# EAGLE design PIC32_dev (EAGLE 6.5.0)
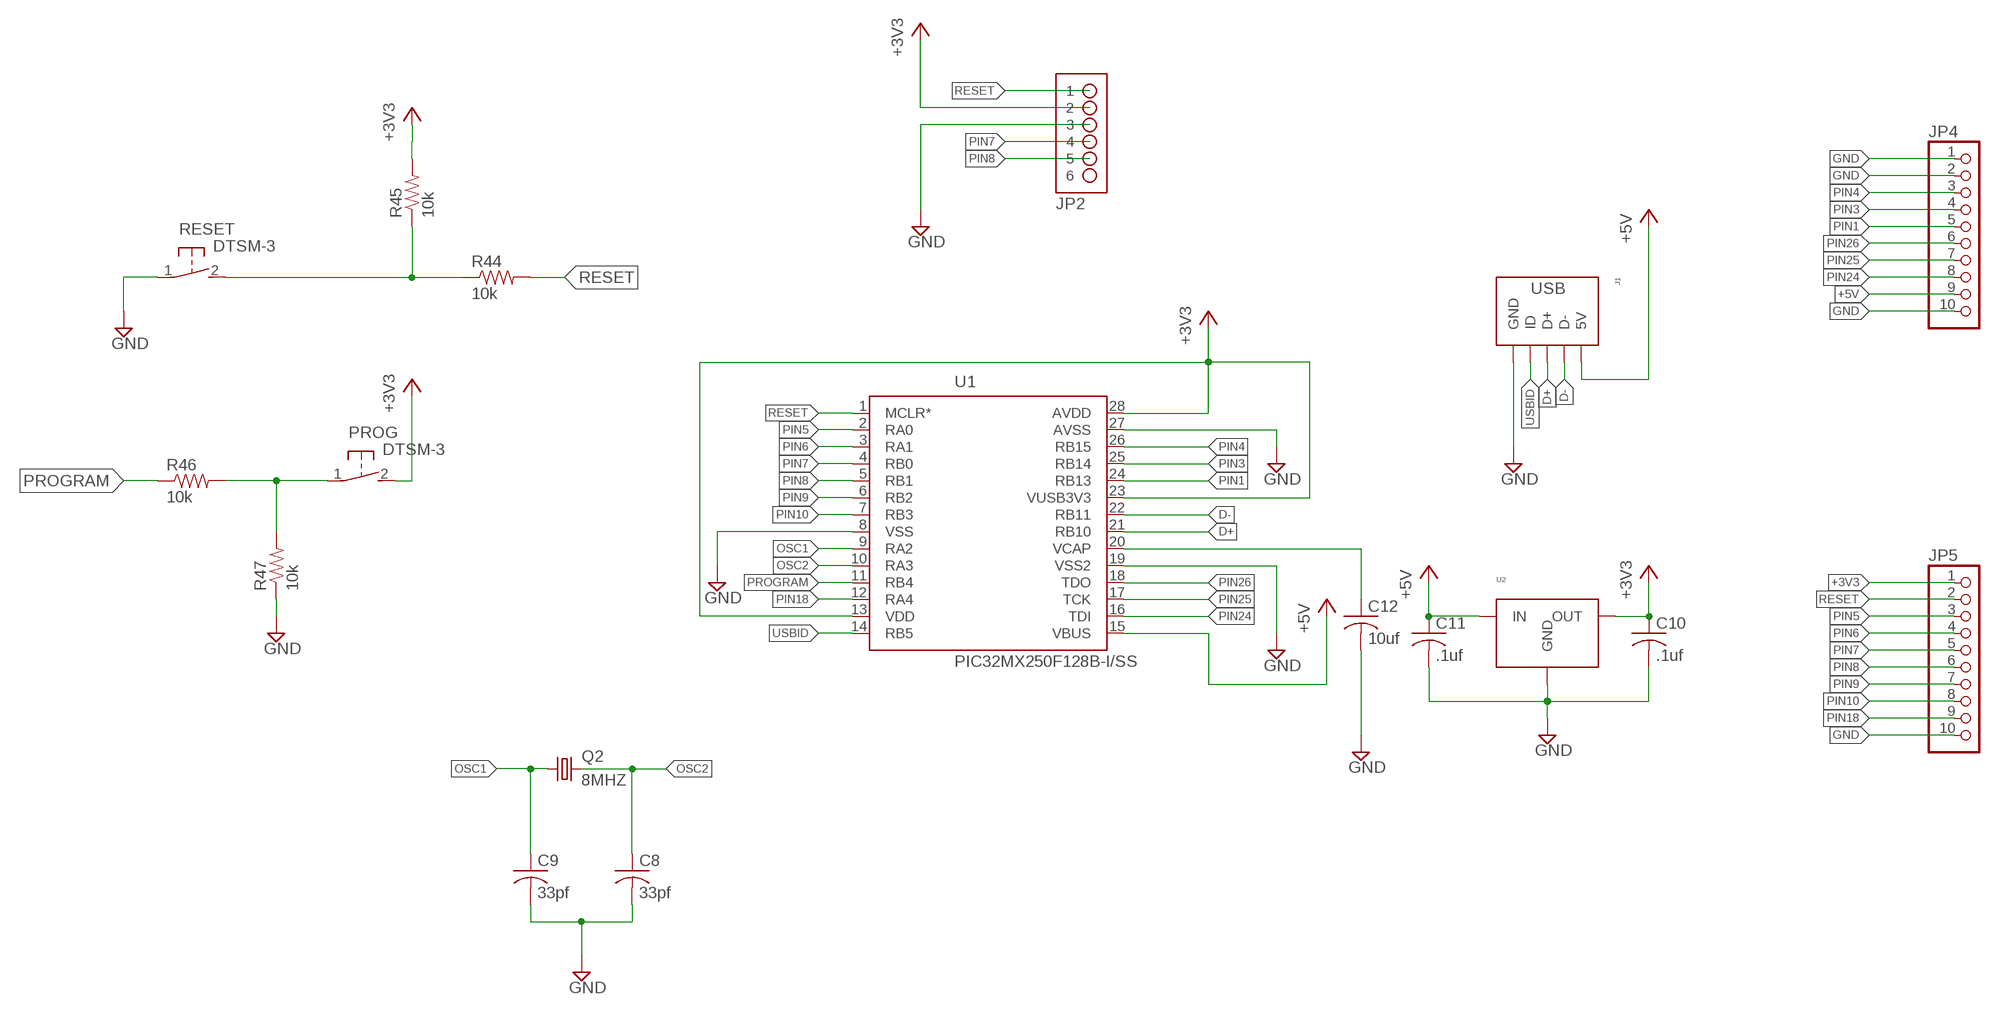
[diagram p0: schematic, sheet 1]

## Parts
C8  33pf  C-USC1206  [C1206]
C9  33pf  C-USC1206  [C1206]
C10  .1uf  C-USC1206  [C1206]
C11  .1uf  C-USC1206  [C1206]
C12  10uf  C-USC1206  [C1206]
J1  USBMC32599  [MC32599]
JP2  HDR-1X6-OFFSET  [HDR-1X6_OFFSET]
JP4  PINHD-1X10  [1X10]
JP5  PINHD-1X10  [1X10]
PROG  DTSM-3  [DTSM-3]
Q2  8MHZ  CRYSTALCTS406  [CTS406]
R44  10k  RESISTOR1206  [1206]
R45  10k  RESISTOR1206  [1206]
R46  10k  RESISTOR1206  [1206]
R47  10k  RESISTOR1206  [1206]
RESET  DTSM-3  [DTSM-3]
U1  PIC32MX250F128B-I/SS  [SOP65P780X200-28N]
U2  FIXED_VOLTAGE_REGDPAK-3  [DPAK-3]

## Nets
+3V3: C10.1 JP2.2 JP5.1 PROG.2 R45.2 U1.13(VDD) U1.23(VUSB3V3) U1.28(AVDD) U2.2(OUT)
+5V: C11.1 J1.V_BUS(5V) JP4.9 U1.15(VBUS) U2.1(IN)
D+: J1.D+ U1.21(RB10)
D-: J1.D- U1.22(RB11)
GND: C8.2 C9.2 C10.2 C11.2 C12.2 J1.GND J1.SH_0(GND) J1.SH_1(GND) J1.SH_2(GND) J1.SH_3(GND) JP2.3 JP4.1 JP4.2 JP4.10 JP5.10 R47.1 RESET.1 U1.8(VSS) U1.19(VSS2) U1.27(AVSS) U2.4(GND)
N$43: C12.1 U1.20(VCAP)
N$58: R44.1 R45.1 RESET.2
N$59: PROG.1 R46.2 R47.2
OSC1: C9.1 Q2.1 U1.9(RA2)
OSC2: C8.1 Q2.3 U1.10(RA3)
PIN1: JP4.5 U1.24(RB13)
PIN3: JP4.4 U1.25(RB14)
PIN4: JP4.3 U1.26(RB15)
PIN5: JP5.3 U1.2(RA0)
PIN6: JP5.4 U1.3(RA1)
PIN7: JP2.4 JP5.5 U1.4(RB0)
PIN8: JP2.5 JP5.6 U1.5(RB1)
PIN9: JP5.7 U1.6(RB2)
PIN10: JP5.8 U1.7(RB3)
PIN18: JP5.9 U1.12(RA4)
PIN24: JP4.8 U1.16(TDI)
PIN25: JP4.7 U1.17(TCK)
PIN26: JP4.6 U1.18(TDO)
PROGRAM: R46.1 U1.11(RB4)
RESET: JP2.1 JP5.2 R44.2 U1.1(MCLR*)
USBID: J1.N/C(ID) U1.14(RB5)
Unconnected: JP2.6

## Library data of the parts
C8-C11 = resistor:C-US: CAPACITOR, American symbol
C12 = rcl:C-US: CAPACITOR, American symbol
J1 = PP_Connectors:USB
JP2 = Mechanical:HDR-1X6-OFFSET: 42 mil hole pattern with 16mil offset for jtag connector
JP4 JP5 = pinhead:PINHD-1X10: PIN HEADER
PROG RESET = a328_dev_v2.4:DTSM-3
Q2 = crystal:CRYSTAL: CRYSTAL; OC_FARNELL: unknown; OC_NEWARK: unknown
R44-R47 = SparkFun-Resistors:RESISTOR: Resistor Basic schematic elements and footprints for 0603, 1206, and PTH resistors.
U1 = Microchip-PIC32MX1-2-3-4-5-6-7:PIC32MX2: IC,32-bit Microcontrollers (up to 128 KB Flash and 32 KB SRAM) with Audio and Graphics Interfaces, USB, and Advanced Analog; MPN: PIC32MX250F128B-I/SS; OC_FARNELL: 2097774; OC_NEWARK: 73T1454; PACKAGE: 28-Lead SSOP; SUPPLIER: Microchip
U2 = PP_PowerIC:FIXED_VOLTAGE_REG

## Board
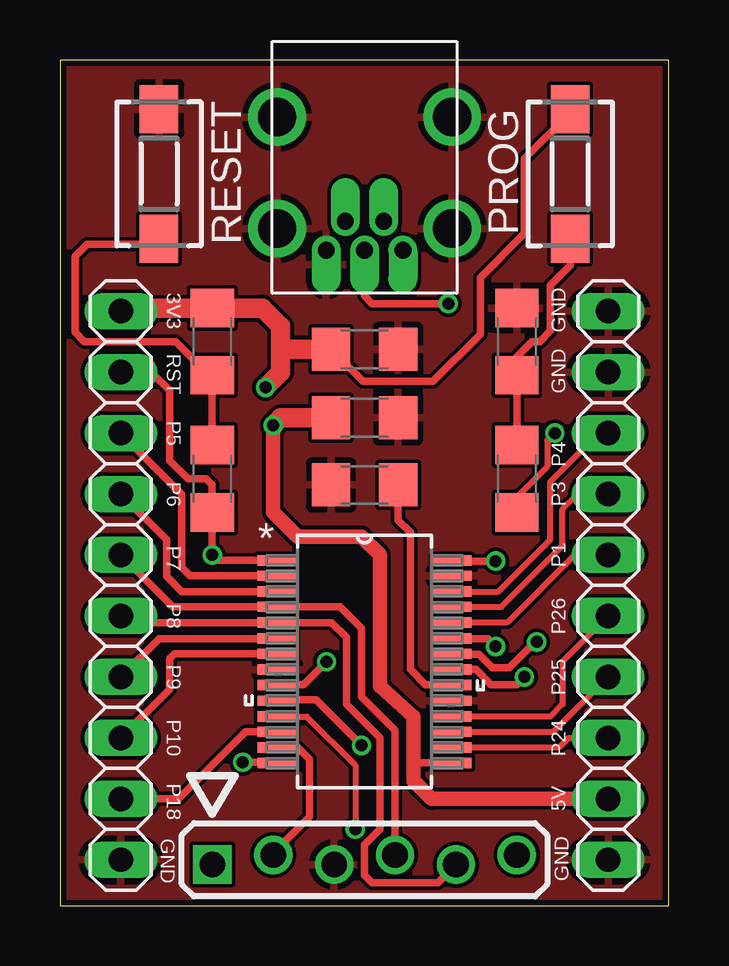
[diagram p1: board, top side]
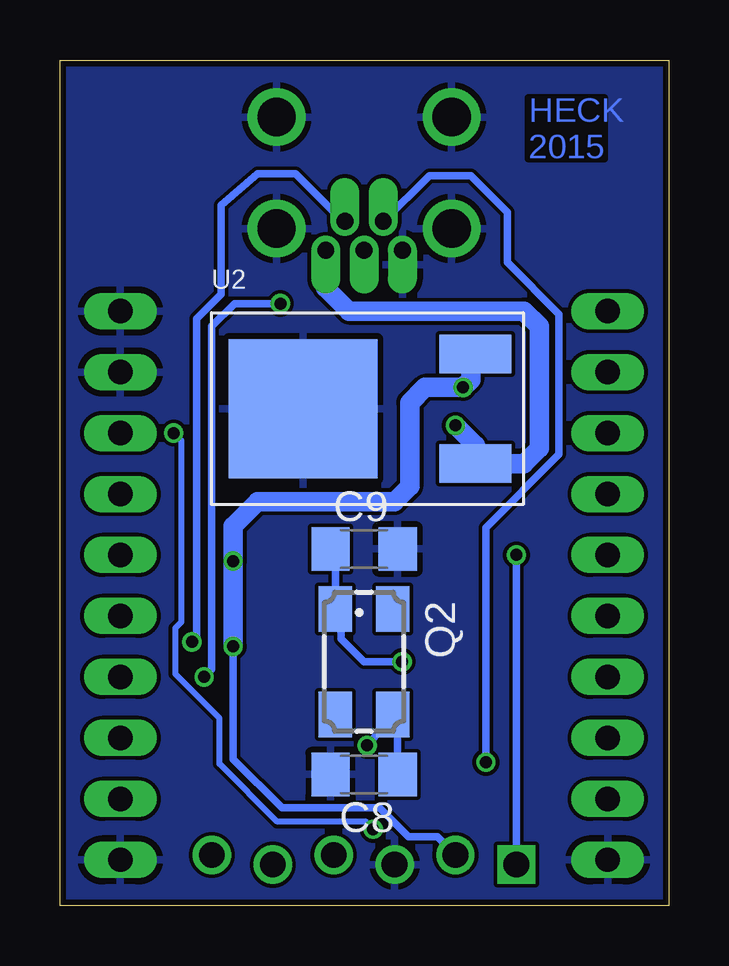
[diagram p2: board, bottom side, seen from below]

Size 25.38 x 35.23 mm. Coordinates in mm from the lower left corner, seen from the top.
Outline: 0,0 25.38,0 25.38,35.23 0,35.23 0,0
Copper layers (1*16): Top 0.035mm / dielectric 1.5mm / Bottom 0.035mm
Design rules "SeeedStudio_2layer_DRU_no_angle_20140221": minimum track width 6mil, minimum drill 12mil, track to track 6mil, track to pad 6mil, pad to pad 6mil, via to via 6mil, smd to smd 0mil, copper to edge 10mil, drill to drill 10mil, minimum pad ring 10mil, minimum via ring 6mil, stop-mask expansion 2mil, vias tented up to drill 100mil, thermal gap 10mil

### Footprints (pad centres in the part's own frame; a part is rotated, then mirrored left to right if it is on the bottom)
C1206 = smd 1.6 x 1.8: 1 -1.4,0; 2 1.4,0
MC32599 = drill 0.7 pad 1.016 offset: D+ 0,0; D- 0.8,1.2; GND -1.6,0; N/C -0.8,1.2; V_BUS 1.6,0 | drill 1.6: SH_0 -3.65,5.55; SH_1 3.65,5.55; SH_2 -3.65,0.9; SH_3 3.65,0.9
HDR-1X6_OFFSET = drill 1.067 square: 1 -0.203,6.35 | drill 1.067: 2 0.203,3.81; 3 -0.203,1.27; 4 0.203,-1.27; 5 -0.203,-3.81; 6 0.203,-6.35
1X10 = drill 1.016 long: 1 -11.43,0; 2 -8.89,0; 3 -6.35,0; 4 -3.81,0; 5 -1.27,0; 6 1.27,0; 7 3.81,0; 8 6.35,0; 9 8.89,0; 10 11.43,0
DTSM-3 = smd 2 x 1.6: 1 -2.7,0; 2 2.7,0
CTS406 = smd 1.9 x 1.4: 1 -2.2,-1.2; 2 2.2,-1.2; 3 2.2,1.2; 4 -2.2,1.2
1206 = smd 1.6 x 1.8: 1 -1.4,0; 2 1.4,0
SOP65P780X200-28N = smd 1.651 x 0.432: 1 -3.632,4.216; 2 -3.632,3.581; 3 -3.632,2.921; 4 -3.632,2.286; 5 -3.632,1.626; 6 -3.632,0.965; 7 -3.632,0.33; 8 -3.632,-0.33; 9 -3.632,-0.965; 10 -3.632,-1.626; 11 -3.632,-2.286; 12 -3.632,-2.921; 13 -3.632,-3.581; 14 -3.632,-4.216; 15 3.632,-4.216; 16 3.632,-3.581; 17 3.632,-2.921; 18 3.632,-2.286; 19 3.632,-1.626; 20 3.632,-0.965; 21 3.632,-0.33; 22 3.632,0.33; 23 3.632,0.965; 24 3.632,1.626; 25 3.632,2.286; 26 3.632,2.921; 27 3.632,3.581; 28 3.632,4.216
DPAK-3 = smd 3 x 1.6: 1 0,-2.285; 2 0,2.285 | smd 6.2 x 5.8: 4 -7.18,0

### Placement (x,y rotation side)
C8  12.7,5.46 180 bottom
C9  12.7,14.86 0 bottom
C10  12.7,23.18 0 top
C11  12.7,20.32 0 top
C12  12.7,17.53 180 top
J1  12.7,27.3 0 top
JP2  12.7,1.91 90 top
JP4  22.86,13.34 270 top
JP5  2.54,13.34 270 top
PROG  21.27,30.48 90 top
Q2  12.7,10.16 270 bottom
R44  6.35,17.78 270 top
R45  6.35,23.5 90 top
R46  19.05,17.78 90 top
R47  19.05,23.5 270 top
RESET  4.13,30.48 270 top
U1  12.7,10.16 0 top
U2  8.06,20.7 0 bottom

### Tracks (layer width: path | path; a pad name or v marks a point on that pad's centre or on a via)
+3V3  (via drill 0.5)
  Top 0.305: U1.23 16.34,11.11 17.84,11.11 v18.16,10.79 | U1.28 16.36,14.35 v18.16,14.35 | 9.04,6.6 U1.13 9.88,6.58 9.91,6.6 10.41,6.1 10.41,3.71 8.81,2.11 JP2.2 | C10.1 12.63,21.84 15.56,21.84 17.53,23.81 17.53,26.16 19.37,28 19.37,31.11 21.27,33.02 PROG.2
  Top 0.813: C10.1 9.21,23.18 | 9.21,23.18 9.21,22.23 v8.57,21.59 | 9.21,23.18 9.21,24.13 8.44,24.89 R45.2 2.67,24.89 JP5.1
  Bottom 0.305: v18.16,10.79 18.16,6.1 16.13,4.06 12.06,4.06 10.86,2.86 9.64,2.86 JP2.2
  Bottom 0.813: v18.16,10.79 v18.16,14.35 18.16,15.81 17.14,16.83 11.43,16.83 10.79,17.46 10.79,20.95 10.16,21.59 v8.57,21.59 8.26,21.91 8.26,22.8 U2.2
+5V  (via drill 0.5)
  Top 0.305: 14.73,5.91 15.07,5.94 U1.15
  Top 0.61: v8.89,20 8.89,16.38 9.91,15.37 12.57,15.37 13.34,14.61 13.34,9.14 14.73,7.87 14.73,5.91 14.73,5.21 15.49,4.45 JP4.9
  Top 0.813: C11.1 9.21,20.32 v8.89,20
  Bottom 0.813: J1.V_BUS 14.3,25.73 13.34,24.77 6.03,24.77 5.4,24.13 5.4,19.05 6.03,18.41 U2.1 8.06,19.18 v8.89,20
D+  (via drill 0.5)
  Top 0.305: U1.21 16.34,9.84 17.34,9.84 17.97,9.21 19.05,9.21 v19.37,9.53 | J1.D+ 12.7,25.4 13.02,25.08 v16.19,25.08
  Bottom 0.305: v19.37,9.53 19.05,9.84 19.05,24.13 18.1,25.08 v16.19,25.08
D-  (via drill 0.5)
  Top 0.305: U1.22 16.34,10.48 17.46,10.48 18.03,9.91 18.73,9.91 19.88,11.05 v19.88,10.99 19.81,11.05
  Bottom 0.305: J1.D- 13.58,28.5 15.56,30.48 17.14,30.48 18.66,29.18 18.66,25.47 19.68,24.45 19.68,11.18 v19.88,10.99
GND
  pour Top: -1.27,36.83 26.67,36.83 26.67,-1.27 -1.27,-1.27
  pour Bottom: -1.27,36.83 26.67,36.83 26.67,-1.27 -1.27,-1.27
N$43
  Top 0.305: C12.1 14.1,16.06 14.61,15.56 14.61,9.84 15.24,9.21 16.32,9.21 U1.20
N$58
  Top 0.305: R44.1 R45.1 | R45.1 6.8,22.09 | RESET.2 3.91,27.56 1.14,27.56 0.64,27.05 0.64,23.88 1.02,23.5 4.83,23.5 6.23,22.09 R45.1
N$59
  Top 0.305: R46.2 R47.2 18.41,22.23 19.68,23.5 20,23.5 20.45,23.94 20.45,25.84 21.27,26.67 PROG.1
OSC1  (via drill 0.5)
  Top 0.305: U1.9 9.08,9.21 10.16,9.21 v11.11,10.16
  Bottom 0.305: v11.11,10.16 12.7,10.16 13.65,11.11 13.65,12.11 Q2.1 13.9,15.04 C9.1
OSC2  (via drill 0.5)
  Top 0.305: U1.10 9.11,8.57 10.67,8.57 v12.57,6.67
  Bottom 0.305: C8.1 11.3,7.76 Q2.3 11.5,7.87 v12.57,6.67
PIN1
  Top 0.254: U1.24 16.36,11.81 18.67,11.81 21.46,14.61 JP4.5
PIN3
  Top 0.254: U1.25 18.41,12.45 20.95,14.99 20.95,16.51 21.59,17.14 JP4.4 22.48,17.14
PIN4
  Top 0.254: U1.26 18.29,13.08 20.45,15.24 20.45,17.65 22.48,19.68 JP4.3
PIN5
  Top 0.305: U1.2 5.44,13.74 5.08,14.1 5.08,17.14 JP5.3
PIN6
  Top 0.305: U1.3 5.08,13.08 4.45,13.72 4.45,15.24 JP5.4
PIN7
  Top 0.305: JP5.5 4.7,12.45 U1.4 11.68,12.45 12.57,11.56 12.57,8.7 13.97,7.3 JP2.4
PIN8
  Top 0.305: JP5.6 2.82,11.79 U1.5 11.33,11.79 11.94,11.18 11.94,8.38 13.34,6.99 13.34,3.17 12.7,2.54 12.7,1.27 13.02,0.95 15.76,0.95 JP2.5
PIN9
  Top 0.305: U1.6 4.14,11.12 JP5.7
PIN10
  Top 0.305: U1.7 4.78,10.49 4.57,10.29 4.57,9.02 JP5.8
PIN18
  Top 0.305: U1.12 7.75,7.24 4.95,4.45 JP5.9
PIN24
  Top 0.254: 16.36,6.6 20.83,6.6 21.21,6.99 JP4.8
  Top 0.305: 16.36,6.6 U1.16
PIN25
  Top 0.254: U1.17 20.57,7.24 JP4.7
PIN26
  Top 0.254: JP4.6 20.95,10.16 20.95,8.38 20.45,7.87 U1.18
PROGRAM  (via drill 0.5)
  Top 0.254: v20.64,19.68 20.32,19.37 20.32,18.29 19.05,17.02 R46.1 | U1.11 10.29,7.87 12.32,5.84 v12.32,3.17
  Top 0.305: 19.55,16.38 R46.1
  Bottom 0.254: v20.64,19.68 20.32,19.37 20.32,11.81 20.57,11.56 20.57,9.65 18.73,7.81 18.73,5.91 16.32,3.49 12.64,3.49 v12.32,3.17
RESET  (via drill 0.5)
  Top 0.305: U1.1 6.58,14.38 v6.35,14.61 R44.2 6.35,17.53 6.1,17.78 5.33,17.78 4.57,18.54 4.57,21.46 3.81,22.23 JP5.2
  Bottom 0.305: JP2.1 v6.35,14.61
USBID  (via drill 0.5)
  Top 0.305: U1.14 9.04,5.97 v7.62,5.97
  Bottom 0.305: v7.62,5.97 7.62,15.75 4.57,18.8 4.57,24.64 6.73,26.8 6.73,28.89 8.26,30.42 9.97,30.42 11.88,28.5 J1.N/C

### Text on the board
Bottom: HECK / 2015
tNames: 3V3 | GND | RST | GND | P5 | P6 | P4 | P3 | P7 | P1 | P8 | P26 | P9 | P25 | P10 | P24 | P18 | 5V | GND | GND
tValues: TANT | PIC32MX250F128B / -I/SS | PROGRAMMER